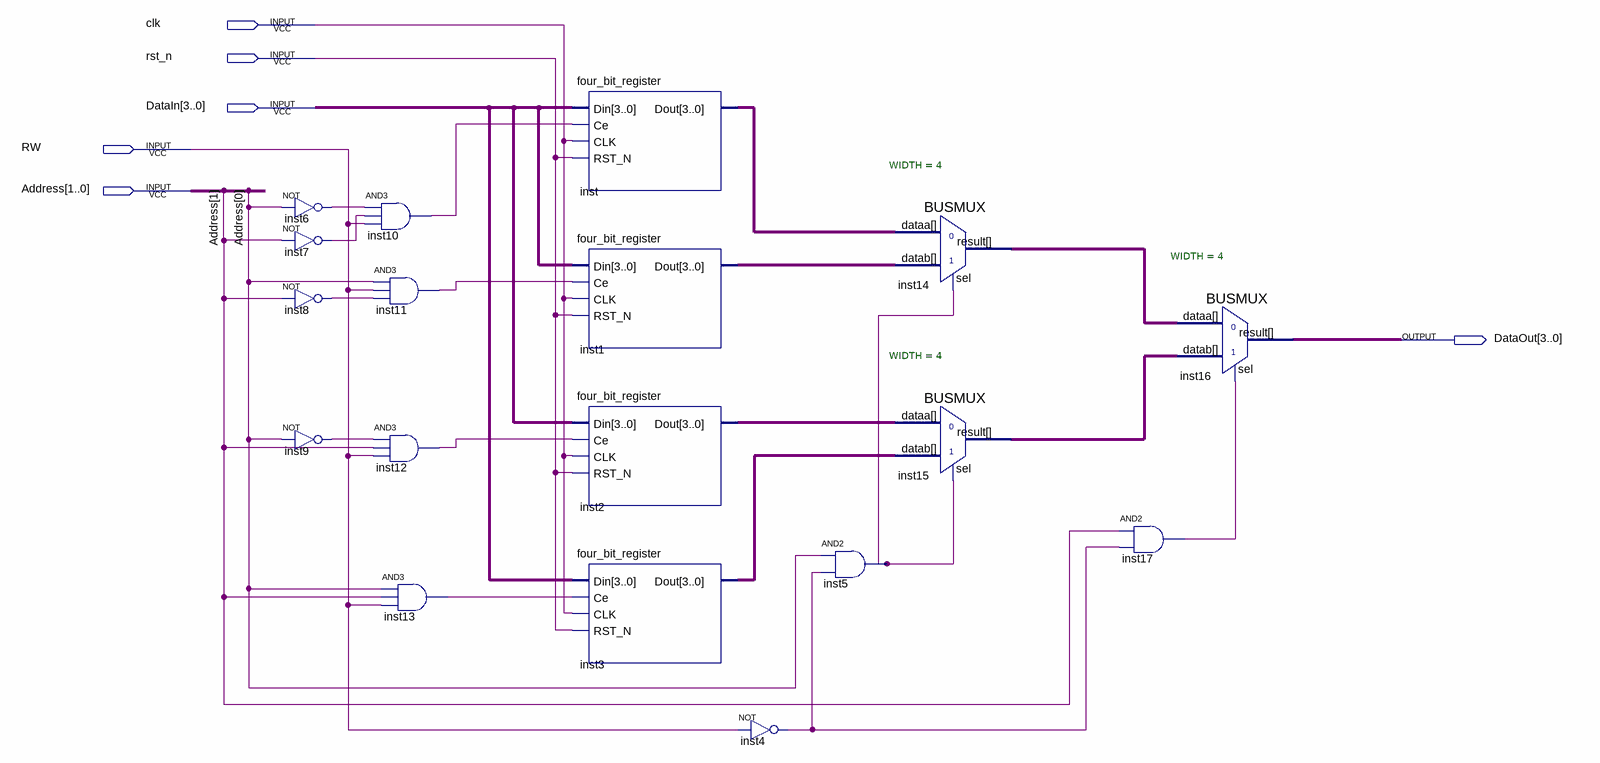
[diagram p0: schematic sheet]
// Quartus schematic fourbit_reg_sram.bdf as structural Verilog: 18 symbols, 6 pins
module fourbit_reg_sram (
  input  clk,
  input  rst_n,
  input  [3:0] DataIn,
  input  RW,
  input  [1:0] Address,
  output [3:0] DataOut
);

  wire inst4_out, inst5_out, inst6_out, inst7_out, inst8_out, inst9_out, inst10_out, inst11_out, inst12_out,
       inst13_out, inst17_out;
  wire [3:0] inst1_dout, inst2_dout, inst3_dout, inst14_result, inst15_result, inst_dout;

  not inst6 (inst6_out, Address[0]);
  not inst7 (inst7_out, Address[1]);
  not inst8 (inst8_out, Address[1]);
  not inst9 (inst9_out, Address[0]);
  and inst10 (inst10_out, inst6_out, inst7_out, RW);
  and inst11 (inst11_out, Address[0], RW, inst8_out);
  and inst12 (inst12_out, inst9_out, Address[1], RW);
  and inst13 (inst13_out, Address[0], Address[1], RW);
  four_bit_register inst (.Din(DataIn), .Ce(inst10_out), .CLK(clk), .RST_N(rst_n), .Dout(inst_dout));
  four_bit_register inst1 (.Din(DataIn), .Ce(inst11_out), .CLK(clk), .RST_N(rst_n), .Dout(inst1_dout));
  four_bit_register inst2 (.Din(DataIn), .Ce(inst12_out), .CLK(clk), .RST_N(rst_n), .Dout(inst2_dout));
  four_bit_register inst3 (.Din(DataIn), .Ce(inst13_out), .CLK(clk), .RST_N(rst_n), .Dout(inst3_dout));
  not inst4 (inst4_out, RW);
  and inst5 (inst5_out, Address[0], inst4_out);
  BUSMUX #(.WIDTH(4)) inst14 (.datab(inst1_dout), .sel(inst5_out), .dataa(inst_dout), .result(inst14_result));
  BUSMUX #(.WIDTH(4)) inst15 (.datab(inst3_dout), .sel(inst5_out), .dataa(inst2_dout), .result(inst15_result));
  and inst17 (inst17_out, Address[1], inst4_out);
  BUSMUX #(.WIDTH(4)) inst16 (.datab(inst15_result), .sel(inst17_out), .dataa(inst14_result), .result(DataOut));
endmodule
